# EAGLE design pvii-001 (EAGLE 9.6.2)
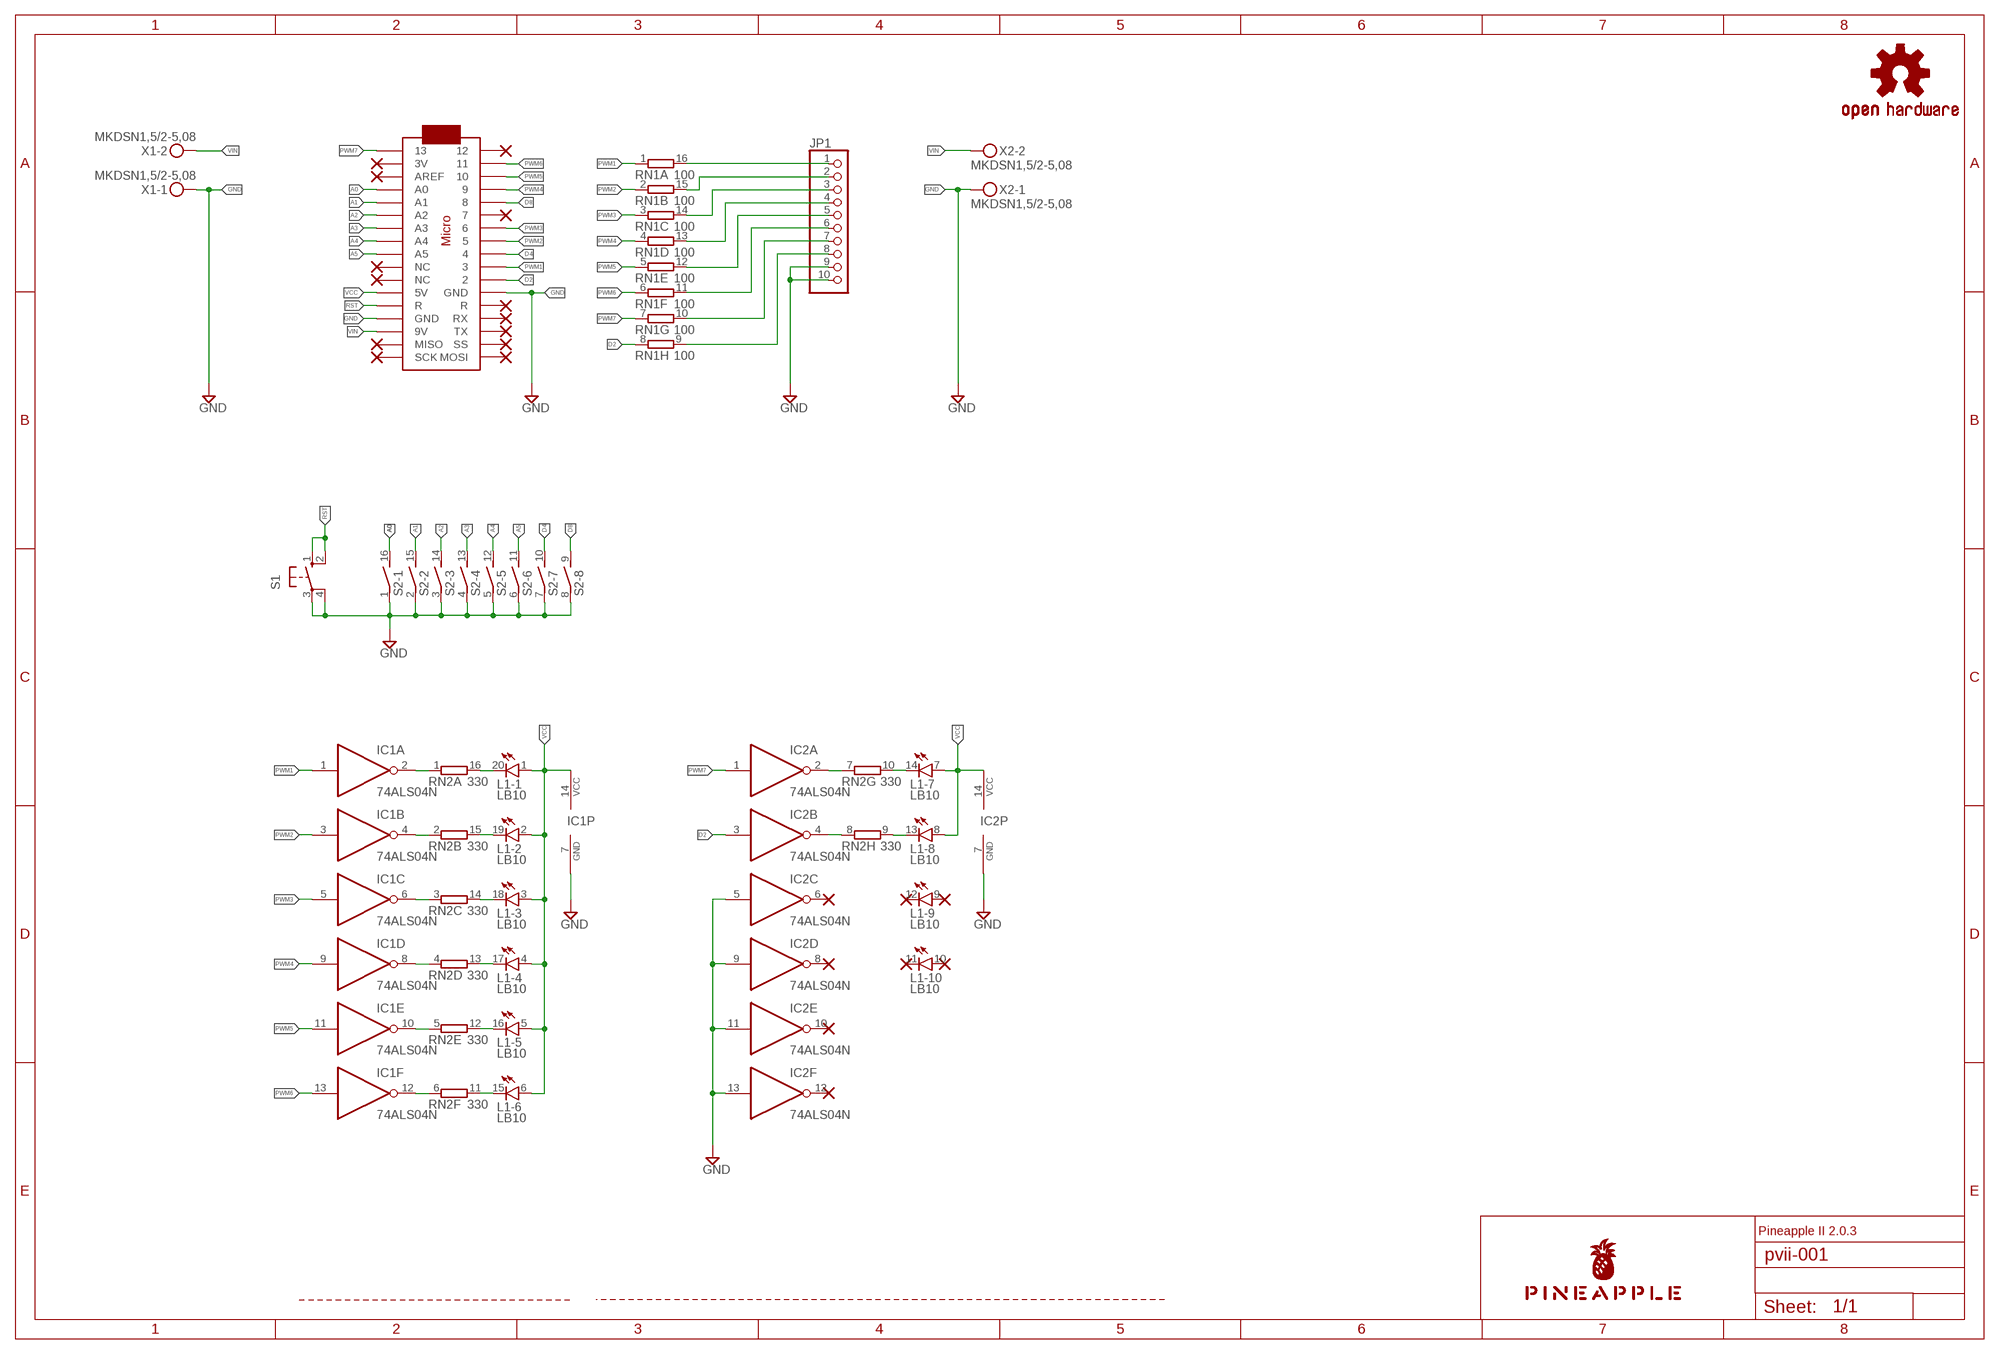
[diagram p0: schematic, sheet 1]

## Parts
IC1  74ALS04N  [DIL14]
IC2  74ALS04N  [DIL14]
JP1  PINHD-1X10  [1X10]
L1  LB10  [LB10]
LOGO1  OSHW-LOGOS-COPPER  [OSHW-LOGO-S_COPPER]
MC1  ARDUINOMICRO  [ARDUINOMICRO]
RN1  100  8R-N  [DIL16]
RN2  330  8R-N  [DIL16]
S1  10-XX  [B3F-10XX]
S2  DIP08S  [DIP08S]
U$1  PINEAPPLE450_SILK  [PINEAPPLE450_SILK]
X1  MKDSN1,5/2-5,08  [MKDSN1,5/2-5,08]
X2  MKDSN1,5/2-5,08  [MKDSN1,5/2-5,08]

## Nets
A0: MC1.P$31(A0) S2.16
A1: MC1.P$30(A1) S2.15
A2: MC1.P$29(A2) S2.14
A3: MC1.P$28(A3) S2.13
A4: MC1.P$27(A4) S2.12
A5: MC1.P$26(A5) S2.11
D2: IC2.3(B:I) MC1.P$11 RN1.8
D4: MC1.P$9 S2.10
D8: MC1.P$5 S2.9
GND [gnd]: IC1.7(P:GND) IC2.5(C:I) IC2.7(P:GND) IC2.9(D:I) IC2.11(E:I) IC2.13(F:I) JP1.9 JP1.10 MC1.P$12(GND) MC1.P$21(GND) S1.3(P) S1.4(P1) S2.1 S2.2 S2.3 S2.4 S2.5 S2.6 S2.7 S2.8 X1.1 X2.1
LED1: IC1.2(A:O) RN2.1
LED1K: L1.20(-1:C) RN2.16
LED2: IC1.4(B:O) RN2.2
LED2K: L1.19(-2:C) RN2.15
LED3: IC1.6(C:O) RN2.3
LED3K: L1.18(-3:C) RN2.14
LED4: IC1.8(D:O) RN2.4
LED4K: L1.17(-4:C) RN2.13
LED5: IC1.10(E:O) RN2.5
LED5K: L1.16(-5:C) RN2.12
LED6: IC1.12(F:O) RN2.6
LED6K: L1.15(-6:C) RN2.11
LED7: IC2.2(A:O) RN2.7
LED7K: L1.14(-7:C) RN2.10
LED8: IC2.4(B:O) RN2.8
LED8K: L1.13(-8:C) RN2.9
OUT1: JP1.1 RN1.16
OUT2: JP1.2 RN1.15
OUT3: JP1.3 RN1.14
OUT4: JP1.4 RN1.13
OUT5: JP1.5 RN1.12
OUT6: JP1.6 RN1.11
OUT7: JP1.7 RN1.10
OUT8: JP1.8 RN1.9
PWM1: IC1.1(A:I) MC1.P$10 RN1.1
PWM2: IC1.3(B:I) MC1.P$8 RN1.2
PWM3: IC1.5(C:I) MC1.P$7 RN1.3
PWM4: IC1.9(D:I) MC1.P$4 RN1.4
PWM5: IC1.11(E:I) MC1.P$3 RN1.5
PWM6: IC1.13(F:I) MC1.P$2 RN1.6
PWM7: IC2.1(A:I) MC1.P$34 RN1.7
RST: MC1.P$13(R) S1.1(S) S1.2(S1)
VCC [power]: IC1.14(P:VCC) IC2.14(P:VCC) L1.1(-1:A) L1.2(-2:A) L1.3(-3:A) L1.4(-4:A) L1.5(-5:A) L1.6(-6:A) L1.7(-7:A) L1.8(-8:A) MC1.P$23(5V)
VIN [superpower]: MC1.P$20(9V) X1.2 X2.2
Unconnected: IC2.6(C:O) IC2.8(D:O) IC2.10(E:O) IC2.12(F:O) L1.9(-9:A) L1.10(-10:A) L1.11(-10:C) L1.12(-9:C) MC1.P$1 MC1.P$6 MC1.P$14(RX) MC1.P$15(TX) MC1.P$16(SS) MC1.P$17(MOSI) MC1.P$18(SCK) MC1.P$19(MISO) MC1.P$22(R) MC1.P$24(NC) MC1.P$25(NC) MC1.P$32(AREF) MC1.P$33(3V)

## Notes on the sheet
- Pineapple II 2.0.3

## Library data of the parts
IC1 IC2 = 74xx-us:74*04: Hex INVERTER
JP1 = pinhead:PINHD-1X10: PIN HEADER
L1 = led:LB10: LED BLOCK 10-LED bar graph, DIL, Siemens
LOGO1 = SparkFun-Aesthetics:OSHW-LOGO: Open-Source Hardware (OSHW) Logo This logo indicates the piece of hardware it is found on incorporates a OSHW license and/or adheres to the definition of open source hardware found here: http://freedomdefined.org/OSHW
MC1 = adafruit:ARDUINOMICRO
RN1 RN2 = resistor-dil:8R-N: DIL RESISTOR; OC_FARNELL: unknown; OC_NEWARK: unknown
S1 = switch-omron:10-XX: OMRON SWITCH; MPN: B3F-1000; OC_FARNELL: 176432; OC_NEWARK: 36M3542
S2 = switch-dil:DIP08S: DIL/CODE SWITCH; OC_FARNELL: unknown; OC_NEWARK: unknown
U$1 = pineapple:PINEAPPLE450_SILK
X1 X2 = con-phoenix-508:MKDSN1,5/2-5,08: MKDSN 1,5/ 2-5,08 Printklemme Nennstrom: 13,5 A Nennspannung: 250 V Rastermaß: 5,08 mm Polzahl: 2 Anschlussart: Schraubanschluss Montage: Löten Anschlussrichtung Leiter/Platine: 0 ° Artikelnummer: 1729128 Source: http://eshop.phoenixcontact.com .. 1729128.pdf

## Net classes
0 default: width 0.152 mm, drill 0.152 mm, clearance 0.152 mm
1 gnd: width 1.016 mm, drill 0.152 mm, clearance 0.152 mm
2 power: width 0.61 mm, drill 0.152 mm, clearance 0.152 mm
3 analog: width 0.305 mm, drill 0.152 mm, clearance 0.152 mm
4 superpower: width 1.016 mm, drill 0.152 mm, clearance 0.152 mm

## Board
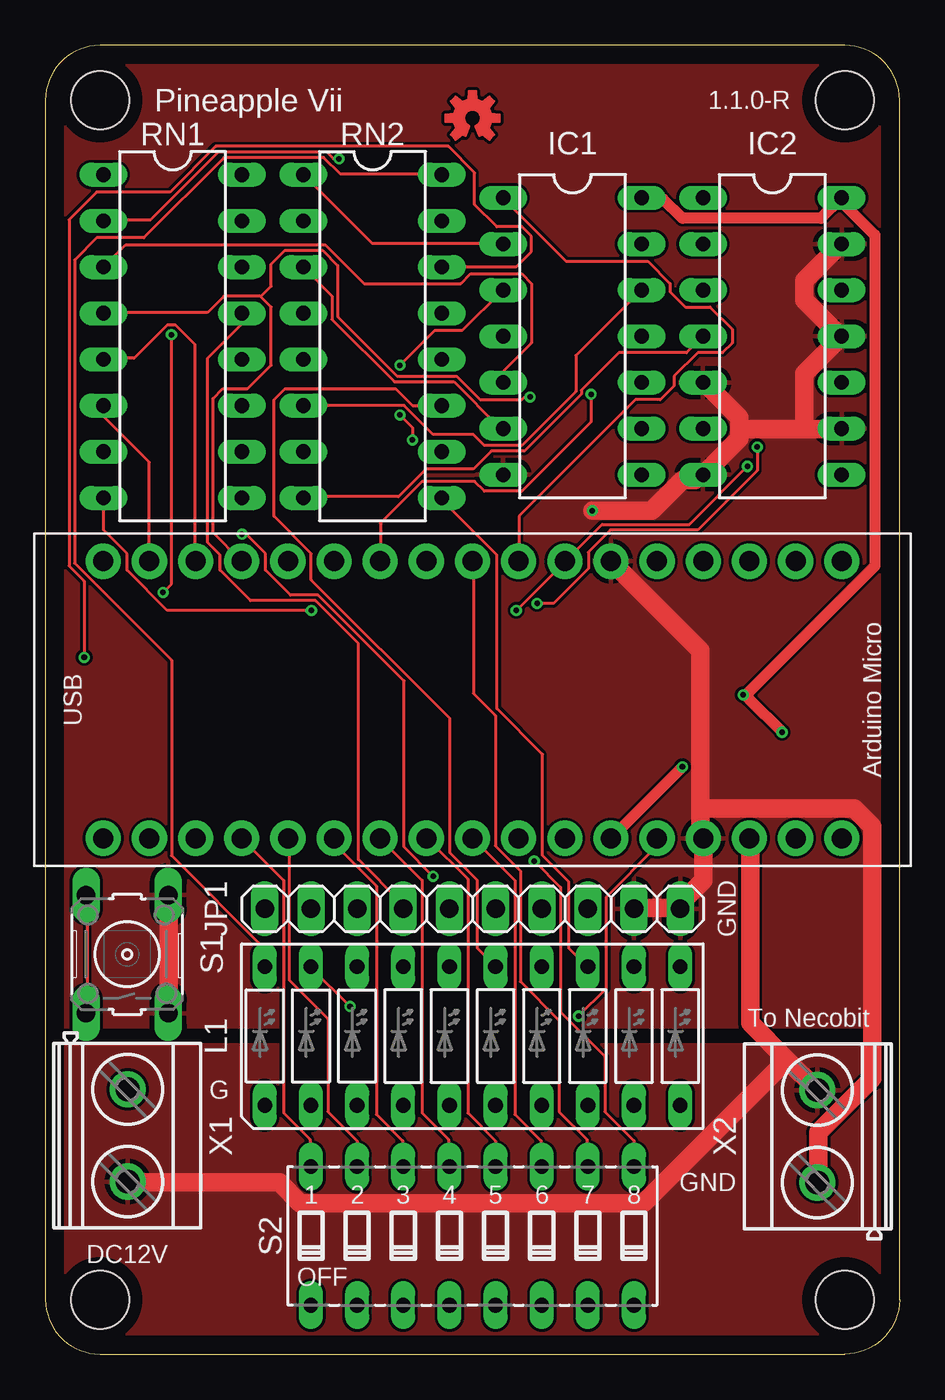
[diagram p1: board, top side]
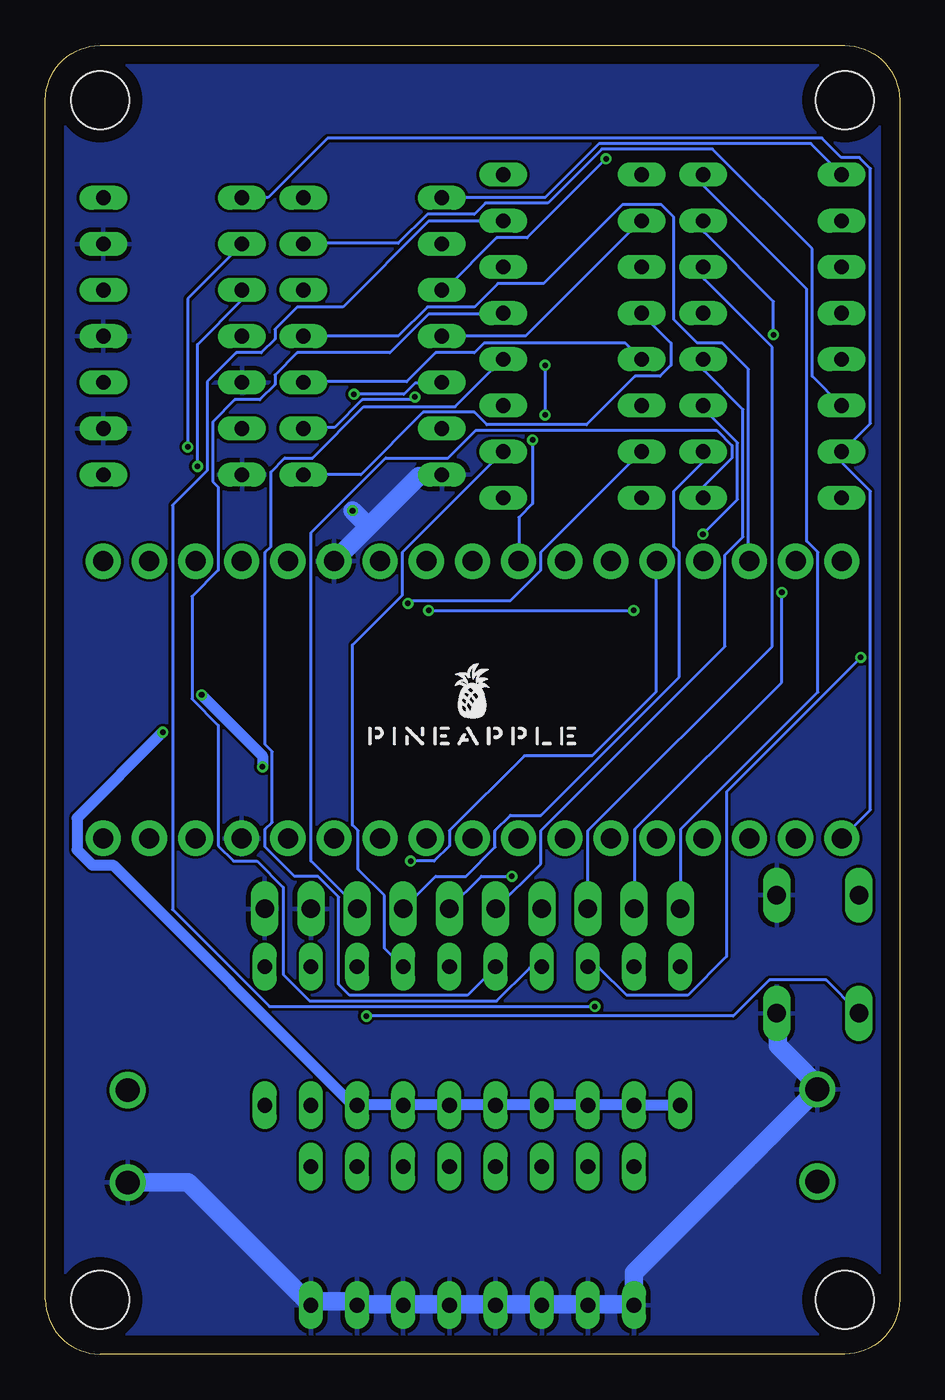
[diagram p2: board, bottom side, seen from below]

Size 47 x 72 mm. Coordinates in mm from the lower left corner, seen from the top.
Outline: 3,0 44,0 arc90 47,3 47,69 arc90 44,72 3,72 arc90 0,69 0,3 arc90 3,0
Copper layers (1*16): Top 0.035mm / dielectric 1.5mm / Bottom 0.035mm
Design rules "SeeedStudio_2layer_DRU_no_angle_20140221": minimum track width 6mil, minimum drill 12mil, track to track 6mil, track to pad 6mil, pad to pad 6mil, via to via 6mil, smd to smd 0mil, copper to edge 10mil, drill to drill 10mil, minimum pad ring 10mil, minimum via ring 6mil, stop-mask expansion 2mil, vias tented up to drill 100mil, thermal gap 10mil
Holes 3.2 mm at 3,3 3,69 44,69 44,3
tRestrict: area 0.8,66.8 to 5.2,71.2; area 0.8,0.8 to 5.2,5.2; area 41.8,66.8 to 46.2,71.2; area 41.8,0.8 to 46.2,5.2; area 0,71 to 47,72; area 0,0 to 47,1; area 0,0 to 1,72; area 46,0 to 47,72
bRestrict: area 0.8,0.8 to 5.2,5.2; area 0.8,66.8 to 5.2,71.2; area 41.8,66.8 to 46.2,71.2; area 41.8,0.8 to 46.2,5.2; area 0,71 to 47,72; area 0,0 to 47,1; area 0,0 to 1,72; area 46,0 to 47,72; area 17,33 to 30,39

### Footprints (pad centres in the part's own frame; a part is rotated, then mirrored left to right if it is on the bottom)
DIL14 = drill 0.813 long: 1 -7.62,-3.81; 2 -5.08,-3.81; 3 -2.54,-3.81; 4 0,-3.81; 5 2.54,-3.81; 6 5.08,-3.81; 7 7.62,-3.81; 8 7.62,3.81; 9 5.08,3.81; 10 2.54,3.81; 11 0,3.81; 12 -2.54,3.81; 13 -5.08,3.81; 14 -7.62,3.81
1X10 = drill 1.016 long: 1 -11.43,0; 2 -8.89,0; 3 -6.35,0; 4 -3.81,0; 5 -1.27,0; 6 1.27,0; 7 3.81,0; 8 6.35,0; 9 8.89,0; 10 11.43,0
LB10 = drill 0.813 long: 1 -11.43,-3.81; 2 -8.89,-3.81; 3 -6.35,-3.81; 4 -3.81,-3.81; 5 -1.27,-3.81; 6 1.27,-3.81; 7 3.81,-3.81; 8 6.35,-3.81; 9 8.89,-3.81; 10 11.43,-3.81; 11 11.43,3.81; 12 8.89,3.81; 13 6.35,3.81; 14 3.81,3.81; 15 1.27,3.81; 16 -1.27,3.81; 17 -3.81,3.81; 18 -6.35,3.81; 19 -8.89,3.81; 20 -11.43,3.81
ARDUINOMICRO = drill 1.1 pad 1.93: P$1 -20.32,7.62; P$2 -17.78,7.62; P$3 -15.24,7.62; P$4 -12.7,7.62; P$5 -10.16,7.62; P$6 -7.62,7.62; P$7 -5.08,7.62; P$8 -2.54,7.62; P$9 0,7.62; P$10 2.54,7.62; P$11 5.08,7.62; P$12 12.7,-7.62; P$13 10.16,-7.62; P$14 12.7,7.62; P$15 15.24,7.62; P$16 17.78,7.62; P$17 20.32,7.62; P$18 20.32,-7.62; P$19 17.78,-7.62; P$20 15.24,-7.62; P$21 7.62,7.62; P$22 10.16,7.62; P$23 7.62,-7.62; P$24 5.08,-7.62; P$25 2.54,-7.62; P$26 0,-7.62; P$27 -2.54,-7.62; P$28 -5.08,-7.62; P$29 -7.62,-7.62; P$30 -10.16,-7.62; P$31 -12.7,-7.62; P$32 -15.24,-7.62; P$33 -17.78,-7.62; P$34 -20.32,-7.62
DIL16 = drill 0.813 long: 1 -8.89,-3.81; 2 -6.35,-3.81; 3 -3.81,-3.81; 4 -1.27,-3.81; 5 1.27,-3.81; 6 3.81,-3.81; 7 6.35,-3.81; 8 8.89,-3.81; 9 8.89,3.81; 10 6.35,3.81; 11 3.81,3.81; 12 1.27,3.81; 13 -1.27,3.81; 14 -3.81,3.81; 15 -6.35,3.81; 16 -8.89,3.81
B3F-10XX = drill 1.016 long: 1 -3.251,2.261; 2 3.251,2.261; 3 -3.251,-2.261; 4 3.251,-2.261
DIP08S = drill 0.813 long: 1 -8.89,-3.81; 2 -6.35,-3.81; 3 -3.81,-3.81; 4 -1.27,-3.81; 5 1.27,-3.81; 6 3.81,-3.81; 7 6.35,-3.81; 8 8.89,-3.81; 9 8.89,3.81; 10 6.35,3.81; 11 3.81,3.81; 12 1.27,3.81; 13 -1.27,3.81; 14 -3.81,3.81; 15 -6.35,3.81; 16 -8.89,3.81
MKDSN1,5/2-5,08 = drill 1.3 pad 2: 1 -2.561,0.025; 2 2.519,0.025

### Placement (x,y rotation side)
IC1  29,56 270 top
IC2  40,56 270 top
JP1  23.5,24.5 0 top
L1  23.5,17.5 0 top
LOGO1  23.5,68 0 top
MC1  23.5,36 0 top
RN1  7,56 270 top
RN2  18,56 270 top
S1  4.5,22 90 top
S2  23.5,6.5 0 top
U$1  23.5,33.5 0 bottom
X1  4.5,12 270 top
X2  42.5,12 90 top

### Tracks (layer width: path | path; a pad name or v marks a point on that pad's centre or on a via)
A0
  Top 0.152: S2.16 14.55,10.36 14.55,11.81 13.11,13.26 13.11,26.06 10.82,28.35 MC1.P$31
A1
  Top 0.152: S2.15 17.14,10.36 17.14,11.73 15.54,13.34 15.54,18.44 13.41,20.57 13.41,28.35 MC1.P$30
A2
  Top 0.152: S2.14 19.66,10.36 19.66,11.73 18.21,13.18 18.21,25.76 15.93,28.04 15.93,28.35 MC1.P$29
A3
  Top 0.152: S2.13 22.17,10.36 22.17,11.81 20.73,13.26 20.73,26.06 18.44,28.35 MC1.P$28
A4
  Top 0.152: S2.12 24.77,10.36 24.77,11.73 23.24,13.26 23.24,26.14 21.03,28.35 MC1.P$27
A5
  Top 0.152: S2.11 27.28,10.36 27.28,11.73 25.83,13.18 25.83,26.06 23.55,28.35 MC1.P$26
D2  (via drill 0.3)
  Top 0.152: v14.63,40.92 6.71,40.92 4.5,43.13 4.5,44.04 3.2,45.34 3.2,47.09 RN1.8 | v25.91,40.92 28.57,43.59 MC1.P$11 28.65,43.66 30.63,45.64 35.43,45.64 v38.63,48.84
  Bottom 0.152: v25.91,40.92 v14.63,40.92 | v38.63,48.84 38.63,55.55 36.2,57.99 36.2,58.52 IC2.3
D4
  Top 0.152: S2.10 29.79,10.36 29.79,11.81 28.27,13.34 28.27,18.36 26.14,20.5 26.14,26.59 24.77,27.96 24.77,35.13 23.55,36.35 23.55,43.59 MC1.P$9
D8  (via drill 0.3)
  Top 0.152: v26.9,27.13 28.35,25.68 28.35,18.82 30.79,16.38 30.79,13.34 32.38,11.73 32.38,10.36 S2.9
  Bottom 0.152: v26.9,27.13 25.6,27.13 24.77,27.96 24.77,28.8 20.65,32.92 16.92,32.92 13.41,36.42 13.41,43.59 MC1.P$5
GND  (via drill 0.3)
  Top 1.016: S1.4 6.78,25.22 6.78,18.82 S1.3 | 38.18,50.9 38.18,51.51 36.2,53.49 IC2.5 | 38.18,50.9 38.18,50.37 IC2.7 35.74,48.08 35.05,48.08 33.38,46.41 v30.1,46.41 | 38.18,50.9 41.76,50.9 | 41.76,50.9 43.74,50.9 IC2.9 | 41.76,50.9 41.76,53.95 43.74,55.93 IC2.11 43.43,56.31 41.76,57.99 41.76,59.05 43.74,61.04 IC2.13 | JP1.9 32.46,24.54 34.9,24.54 JP1.10 35.13,24.99 36.2,26.06 36.2,28.35 MC1.P$12 36.04,28.88 36.04,30.02 | 36.04,30.02 36.04,38.71 31.17,43.59 MC1.P$21 | 36.04,30.02 44.5,30.02 45.49,29.03 45.49,15.16 42.52,12.19 42.52,9.45 X2.1
  Bottom 1.016: X2.1 39.14,9.44 S2.8 31.93,2.9 30.33,2.9 S2.7 29.79,2.74 27.81,2.74 S2.6 27.28,2.74 25.22,2.74 S2.5 24.77,2.74 22.71,2.74 S2.4 22.17,2.74 20.19,2.74 S2.3 19.66,2.74 17.6,2.74 S2.2 17.14,2.74 15.09,2.74 S2.1 14.61,4.48 X1.1 4.72,15.01 6.71,16.99 6.71,18.75 S1.3 | 29.22,45.53 31.09,43.66 MC1.P$21 | 29.22,45.53 26.44,48.31 25.22,48.31 IC1.7 | 29.22,45.53 v30.1,46.41
  pour Top: -1,18 48,18 48,73 -1,73
  pour Bottom: -2,74 -2,-2 49,-2 49,74
LED1
  Top 0.152: IC1.2 25.15,61.11 17.98,61.11 14.25,64.85 RN2.1
LED1K
  Top 0.152: L1.20 12.04,21.34 12.04,22.33 6.93,27.43 6.93,38.18 1.6,43.51 1.6,60.2 2.82,61.42 5.41,61.42 9.83,65.84 15.32,65.84 16.23,64.92 21.79,64.92 RN2.16
LED2
  Bottom 0.152: IC1.4 25.15,56.01 20.57,56.01 14.25,62.33 RN2.2
LED2K  (via drill 0.3)
  Top 0.152: v16.76,19.13 14.63,21.26 L1.19
  Bottom 0.152: v16.76,19.13 34.67,19.13 40.01,24.46 40.01,46.71 38.1,48.62 38.1,53.49 36.5,55.09 35.13,55.09 34.37,55.85 34.37,56.39 33.15,57.61 30.63,57.61 25.91,62.33 21.87,62.33 RN2.15
LED3
  Top 0.152: IC1.6 25.15,50.98 24.99,50.98 22.48,53.49 19.2,53.49 15.77,56.92 15.77,58.22 14.25,59.74 RN2.3
LED3K  (via drill 0.3)
  Top 0.152: v2.13,38.33 2.13,42.52 1.29,43.36 1.29,62.41 2.82,63.93 6.86,63.93 9.37,66.45 22.17,66.45 23.62,65 23.62,63.25 24.84,62.03 26.21,62.03 26.75,61.49 26.75,60.66 25.91,59.82 21.87,59.82 RN2.14
  Bottom 0.152: v2.13,38.33 9.53,30.94 9.53,21.87 11.66,19.74 15.01,19.74 16.54,21.26 17.14,21.26 L1.18
LED4
  Bottom 0.152: IC1.8 32.77,48.39 29.64,48.39 26.21,51.82 23.39,51.82 22.71,51.13 17.22,51.13 14.55,53.8 13.18,53.8 12.57,54.41 12.57,55.63 14.17,57.23 RN2.4
LED4K
  Bottom 0.152: L1.17 19.74,21.26 20.34,21.26 22.17,19.43 32.46,19.43 33.91,20.88 33.91,25.68 35.36,27.13 36.65,27.13 37.49,27.96 37.49,34.59 38.94,36.04 38.94,41.68 37.49,43.13 37.49,47.7 37.8,48.01 37.8,51.28 36.58,52.5 35.2,52.5 34.37,53.34 34.37,53.87 33.15,55.09 28.04,55.09 25.91,57.23 21.87,57.23 RN2.13
LED5
  Bottom 0.152: IC1.10 32.77,53.49 27.13,53.49 25.53,55.09 23.39,55.09 22.86,55.63 15.09,55.63 14.25,54.79 RN2.5
LED5K
  Bottom 0.152: RN2.12 21.87,54.71 24.46,52.12 29.49,52.12 32.31,49.3 33.83,49.3 34.59,48.54 34.59,44.42 34.9,44.12 34.9,33.53 34.52,33.15 34.52,29.26 34.9,28.88 34.9,27.89 33.3,26.29 32,26.29 30.86,25.15 30.86,20.34 30.25,19.74 23.77,19.74 22.25,21.26 L1.16
LED6
  Top 0.152: RN2.6 14.25,52.2 19.74,52.2 21.34,50.6 23.55,50.6 24.16,49.99 26.21,49.99 29.18,52.96 29.18,54.94 32.77,58.52 IC1.12
LED6K
  Top 0.152: RN2.11 21.79,52.2 20.19,52.2 19.28,53.11 13.18,53.11 12.57,52.5 12.57,46.1 14.63,44.04 14.63,42.6 22.25,34.98 22.25,27.58 23.77,26.06 23.77,22.33 24.77,21.34 L1.15
LED7  (via drill 0.3)
  Top 0.152: v27.05,41.3 27.96,41.3 29.87,43.2 29.87,44.12 31.09,45.34 35.89,45.34 39.17,48.62 v39.17,49.91
  Bottom 0.152: v27.05,41.3 26.9,41.45 21.41,41.45 19.74,43.13 19.74,44.12 14.25,49.61 RN2.7 | v39.17,49.91 39.17,58.06 36.2,61.04 IC2.2
LED7K
  Bottom 0.152: RN2.10 21.87,49.61 27.36,44.12 27.36,41.76 30.1,39.01 30.1,29.11 29.79,28.8 29.79,26.67 28.35,25.22 28.35,22.33 27.36,21.34 L1.14
LED8
  Top 0.152: RN2.8 14.25,47.17 19.43,47.17 20.95,48.69 23.55,48.69 24.54,49.68 26.36,49.68 29.49,52.81 29.49,53.03 31.55,55.09 35.28,55.09 36.12,55.93 IC2.4
LED8K
  Top 0.152: RN2.9 21.87,47.09 21.87,46.94 24.84,43.97 24.84,35.51 27.36,32.99 27.36,27.43 28.8,25.98 28.8,22.33 29.79,21.34 L1.13
OUT1
  Bottom 0.152: RN1.16 10.74,64.85 10.74,64.24 5.11,58.6 5.11,44.73 4.5,44.12 4.5,36.42 12.04,28.88 12.04,24.54 JP1.1
OUT2  (via drill 0.3)
  Top 0.152: v6.93,56.08 6.93,42.37 v6.48,41.91
  Bottom 0.152: v6.93,56.08 6.93,57.91 10.74,61.72 10.74,62.33 RN1.15 | v6.48,41.91 6.48,36.96 14.55,28.88 14.55,24.54 JP1.2
OUT3
  Bottom 0.152: RN1.14 10.74,59.74 10.74,59.13 7.01,55.4 7.01,38.94 17.14,28.8 17.14,24.54 JP1.3
OUT4
  Top 0.152: RN1.13 10.74,57.23 10.74,56.62 8.91,54.79 8.91,44.65 9.6,43.97 9.6,43.13 11.28,41.45 14.86,41.45 17.22,39.09 17.22,27.2 19.66,24.77 19.66,24.54 JP1.4
OUT5
  Bottom 0.152: RN1.12 10.74,54.71 10.74,54.1 8.61,51.97 8.61,44.96 9.6,43.97 9.6,38.94 19.74,28.8 19.74,26.98 22.17,24.54 JP1.5
OUT6  (via drill 0.3)
  Top 0.152: v10.82,45.11 11.05,45.11 12.12,44.04 12.12,43.13 13.49,41.76 15.01,41.76 19.74,37.03 19.74,27.89 v21.34,26.29
  Bottom 0.152: v10.82,45.11 8.91,47.02 8.91,50.14 10.74,51.97 10.74,52.12 RN1.11 | v21.34,26.29 23.01,26.29 24.77,24.54 JP1.6
OUT7
  Bottom 0.152: RN1.10 10.82,49.61 10.82,49.07 12.42,47.47 12.42,44.42 12.12,44.12 12.12,37.26 19.74,29.64 21.41,29.64 22.25,28.8 22.25,27.89 23.85,26.29 25.53,26.29 27.28,24.54 JP1.7
OUT8
  Bottom 0.152: RN1.9 10.74,47.17 10.74,47.78 9.22,49.3 9.22,49.99 10.06,50.83 23.32,50.83 24.84,49.3 28.27,49.3 32.38,45.19 32.38,27.13 29.79,24.54 JP1.8
PWM1
  Top 0.152: MC1.P$10 26.06,43.66 26.06,46.1 32.46,52.5 33.83,52.5 34.59,53.26 34.59,53.8 35.89,55.09 37.26,55.09 37.8,55.63 37.8,56.39 36.58,57.61 35.2,57.61 34.37,58.45 34.37,58.9 33.15,60.12 28.65,60.12 25.22,63.55 IC1.1
  Bottom 0.152: IC1.1 25.15,63.63 19.51,63.63 16.54,66.6 4.88,66.6 3.2,64.92 RN1.1
PWM2  (via drill 0.3)
  Top 0.152: v16.15,65.76 15.85,65.76 15.47,66.14 9.53,66.14 5.79,62.41 3.2,62.41 RN1.2 | v20.19,50.29 20.19,50.98 v19.51,51.66 | v19.51,54.41 21.41,56.31 22.94,56.31 25.15,58.52 IC1.3
  Bottom 0.152: v16.15,65.76 20.5,61.42 22.17,61.42 24.99,58.6 25.15,58.6 IC1.3 | v20.19,50.29 20.19,46.79 20.95,46.02 20.95,43.66 MC1.P$8 | v19.51,54.41 v19.51,51.66
PWM3  (via drill 0.3)
  Top 0.152: IC1.5 25.22,53.49 25.22,54.1 26.75,55.63 26.75,58.9 26.21,59.44 23.39,59.44 22.86,58.9 17.53,58.9 15.39,61.04 4.42,61.04 RN1.3 | v30.02,52.81 30.02,51.28 26.21,47.47 24.16,47.47 23.62,48.01 20.73,48.01 18.44,45.72 18.44,43.66 MC1.P$7
  Bottom 0.152: v30.02,52.81 27.28,52.81 26.67,53.42 25.22,53.42 IC1.5
PWM4  (via drill 0.3)
  Top 0.152: 11.85,58.18 12.42,57.61 12.42,54.41 11.12,53.11 9.75,53.11 9.22,52.58 9.22,45.19 10.74,43.66 MC1.P$4 | 11.85,58.18 11.81,58.22 9.83,58.22 8.91,57.3 3.2,57.3 RN1.4 | v26.67,52.65 26.36,52.65 26.21,52.5 23.93,52.5 22.63,53.8 19.36,53.8 16.08,57.07 16.08,59.89 15.24,60.73 13.18,60.73 12.42,59.97 12.42,58.75 11.85,58.18
  Bottom 0.152: v26.67,52.65 26.82,52.5 29.57,52.5 31.09,50.98 32.77,50.98 IC1.9
PWM5
  Top 0.152: RN1.5 3.2,54.79 4.88,54.79 6.71,56.62 7.16,56.62 8.23,55.55 8.23,43.66 MC1.P$3
  Bottom 0.152: IC1.11 32.77,56.01 27.58,56.01 25.98,57.61 23.39,57.61 22.1,58.9 19.58,58.9 15.24,63.25 13.11,63.25 12.42,62.56 12.42,56.92 11.12,55.63 9.75,55.63 8.31,54.18 8.31,43.66 MC1.P$3
PWM6
  Top 0.152: RN1.6 3.2,52.12 3.2,51.59 5.71,49.07 5.71,43.66 MC1.P$2
  Bottom 0.152: IC1.13 32.77,61.11 27.58,61.11 25.98,62.71 23.39,62.71 22.78,63.32 19.36,63.32 16.38,66.29 10.29,66.29 4.8,60.81 4.8,53.8 RN1.6
PWM7
  Bottom 0.152: MC1.P$34 3.12,28.42 1.6,29.95 1.6,47.47 3.12,49 3.12,49.61 RN1.7 3.12,49.68 1.6,51.21 1.6,65.23 2.21,65.84 3.2,65.84 4.27,66.9 31.47,66.9 34.75,63.63 36.12,63.63 IC2.1
RST  (via drill 0.3)
  Top 0.152: S1.1 2.29,18.82 2.29,25.22 S1.2 | v29.34,18.59 30.86,20.12 30.86,25.15 33.6,27.89 33.6,28.35 MC1.P$13
  Bottom 0.152: v29.34,18.59 9.14,18.59 7.16,20.57 4.04,20.57 2.29,18.82 S1.1
VCC  (via drill 0.3)
  Top 0.61: IC1.14 32.84,63.55 33.98,63.55 35.05,62.48 42.67,62.48 43.74,63.55 IC2.14 43.89,63.32 45.64,61.57 45.64,43.36 38.56,36.27 | v35.05,32.31 31.17,28.42 MC1.P$23 | 38.56,36.27 v38.41,36.27 | v40.54,34.21 38.71,36.04 38.56,36.27
  Bottom 0.61: L1.1 12.12,13.72 14.55,13.72 L1.2 14.86,13.72 17.14,13.72 L1.3 17.45,13.72 19.66,13.72 L1.4 19.96,13.72 22.17,13.72 L1.5 22.48,13.72 24.77,13.72 L1.6 25.07,13.72 27.28,13.72 L1.7 27.58,13.72 29.79,13.72 L1.8 30.1,13.87 30.25,13.87 43.28,26.9 44.42,26.9 45.26,27.74 45.26,29.49 v40.54,34.21 | v35.05,32.31 35.05,32.92 v38.41,36.27
VIN
  Top 1.016: 40.8,16.19 42.44,14.55 X2.2 | 40.8,16.19 38.79,18.21 38.79,28.35 MC1.P$20 | 40.8,16.19 32.92,8.31 14.02,8.31 12.88,9.45 4.57,9.45 X1.2
  pour Top: -1,-1 48,-1 48,17 -1,17

### Text on the board
tNames: Pineapple Vii | 1.1.0-R | USB | Arduino Micro | GND | To Necobit | G | GND | DC12V